# EAGLE design power_supply (EAGLE 6.6.0)
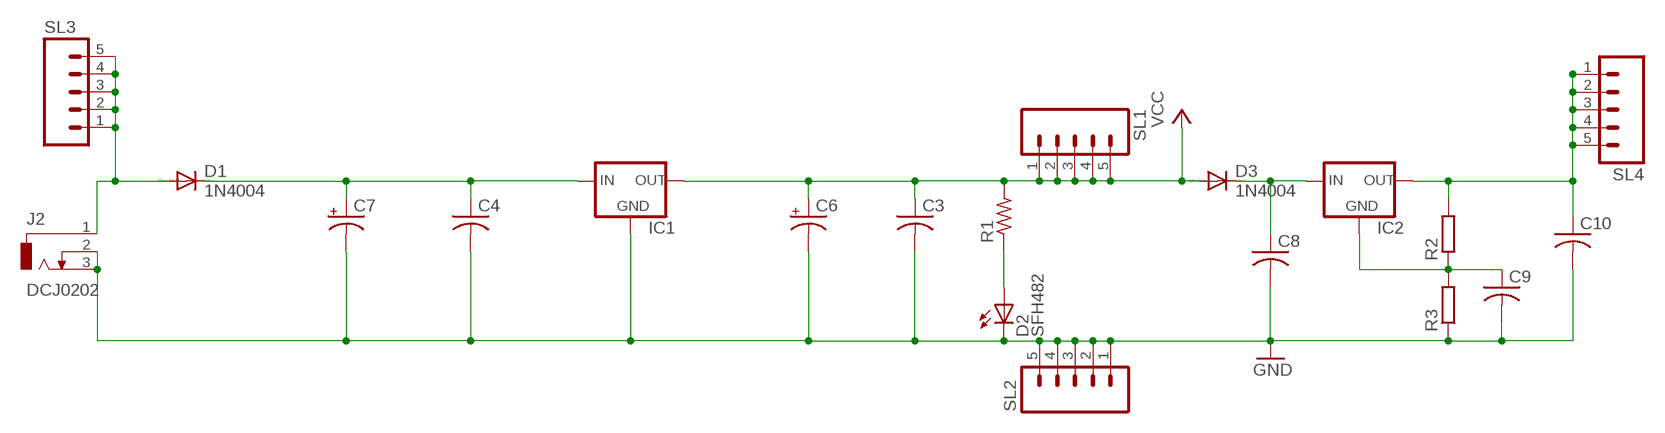
[diagram p0: schematic, sheet 1]

## Parts
C3  C-US025-025X050  [C025-025X050]
C4  C-US025-025X050  [C025-025X050]
C6  CPOL-USE3.5-10  [E3,5-10]
C7  CPOL-USE3.5-10  [E3,5-10]
C8  C-US025-025X050  [C025-025X050]
C9  C-US025-025X050  [C025-025X050]
C10  C-US025-025X050  [C025-025X050]
D1  1N4004  [DO41-10]
D2  SFH482  [SFH482]
D3  1N4004  [DO41-10]
IC1  78MXXS  [78MXXS]
IC2  78MXXS  [78MXXS]
J2  DCJ0202  [DCJ0202]
R1  R-US_0204/7  [0204/7]
R2  R-EU_0204/7  [0204/7]
R3  R-EU_0204/7  [0204/7]
SL1  M05  [05P]
SL2  M05  [05P]
SL3  M05  [05P]
SL4  M05  [05P]

## Nets
GND: C3.2 C4.2 C6.- C7.- C8.2 C9.2 C10.2 D2.K(C) IC1.GND J2.2 J2.3 R3.1 SL2.1 SL2.2 SL2.3 SL2.4 SL2.5
N$1: C4.1 C7.+ D1.C IC1.IN
N$2: D2.A R1.1
N$3: D1.A J2.1 SL3.1 SL3.2 SL3.3 SL3.4 SL3.5
N$4: C8.1 D3.C IC2.IN
N$5: C10.1 IC2.OUT R2.2 SL4.1 SL4.2 SL4.3 SL4.4 SL4.5
N$6: C9.1 IC2.GND R2.1 R3.2
VCC: C3.1 C6.+ D3.A IC1.OUT R1.2 SL1.1 SL1.2 SL1.3 SL1.4 SL1.5

## Library data of the parts
C3 C4 C8-C10 = rcl:C-US: CAPACITOR, American symbol
C6 C7 = resistor:CPOL-US: POLARIZED CAPACITOR, American symbol
D1 D3 = diode:1N4004: DIODE general purpose rectifier, 1 A
D2 = led:SFH482: IR LED infrared emitting diode, Infineon
IC1 IC2 = v-reg:78MXXS: VOLTAGE REGULATOR
J2 = con-jack:DCJ0202: DC POWER JACK Source: DCJ0202.pdf; OC_FARNELL: unknown; OC_NEWARK: unknown
R1 = resistor:R-US_: RESISTOR, American symbol
R2 R3 = rcl:R-EU_: RESISTOR, European symbol
SL1-SL4 = con-amp-quick:M05: AMP QUICK CONNECTOR; OC_FARNELL: unknown; OC_NEWARK: unknown

## Board
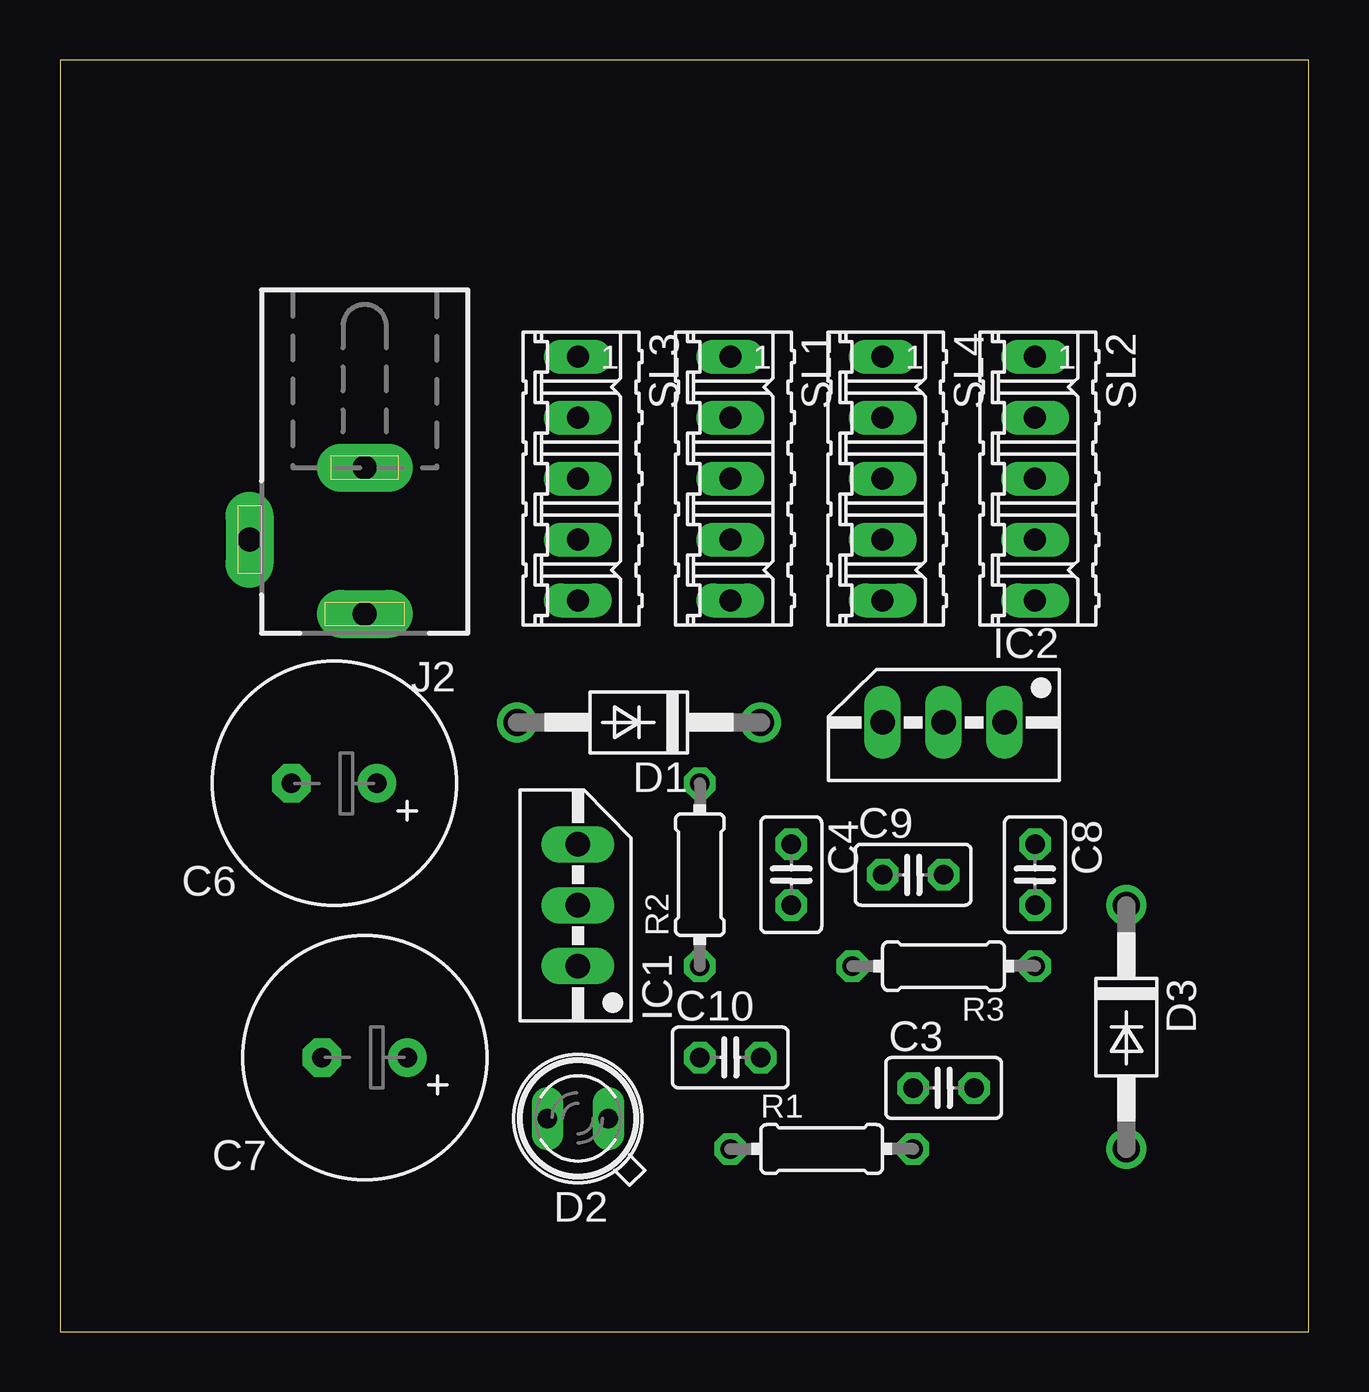
[diagram p1: board, top side]
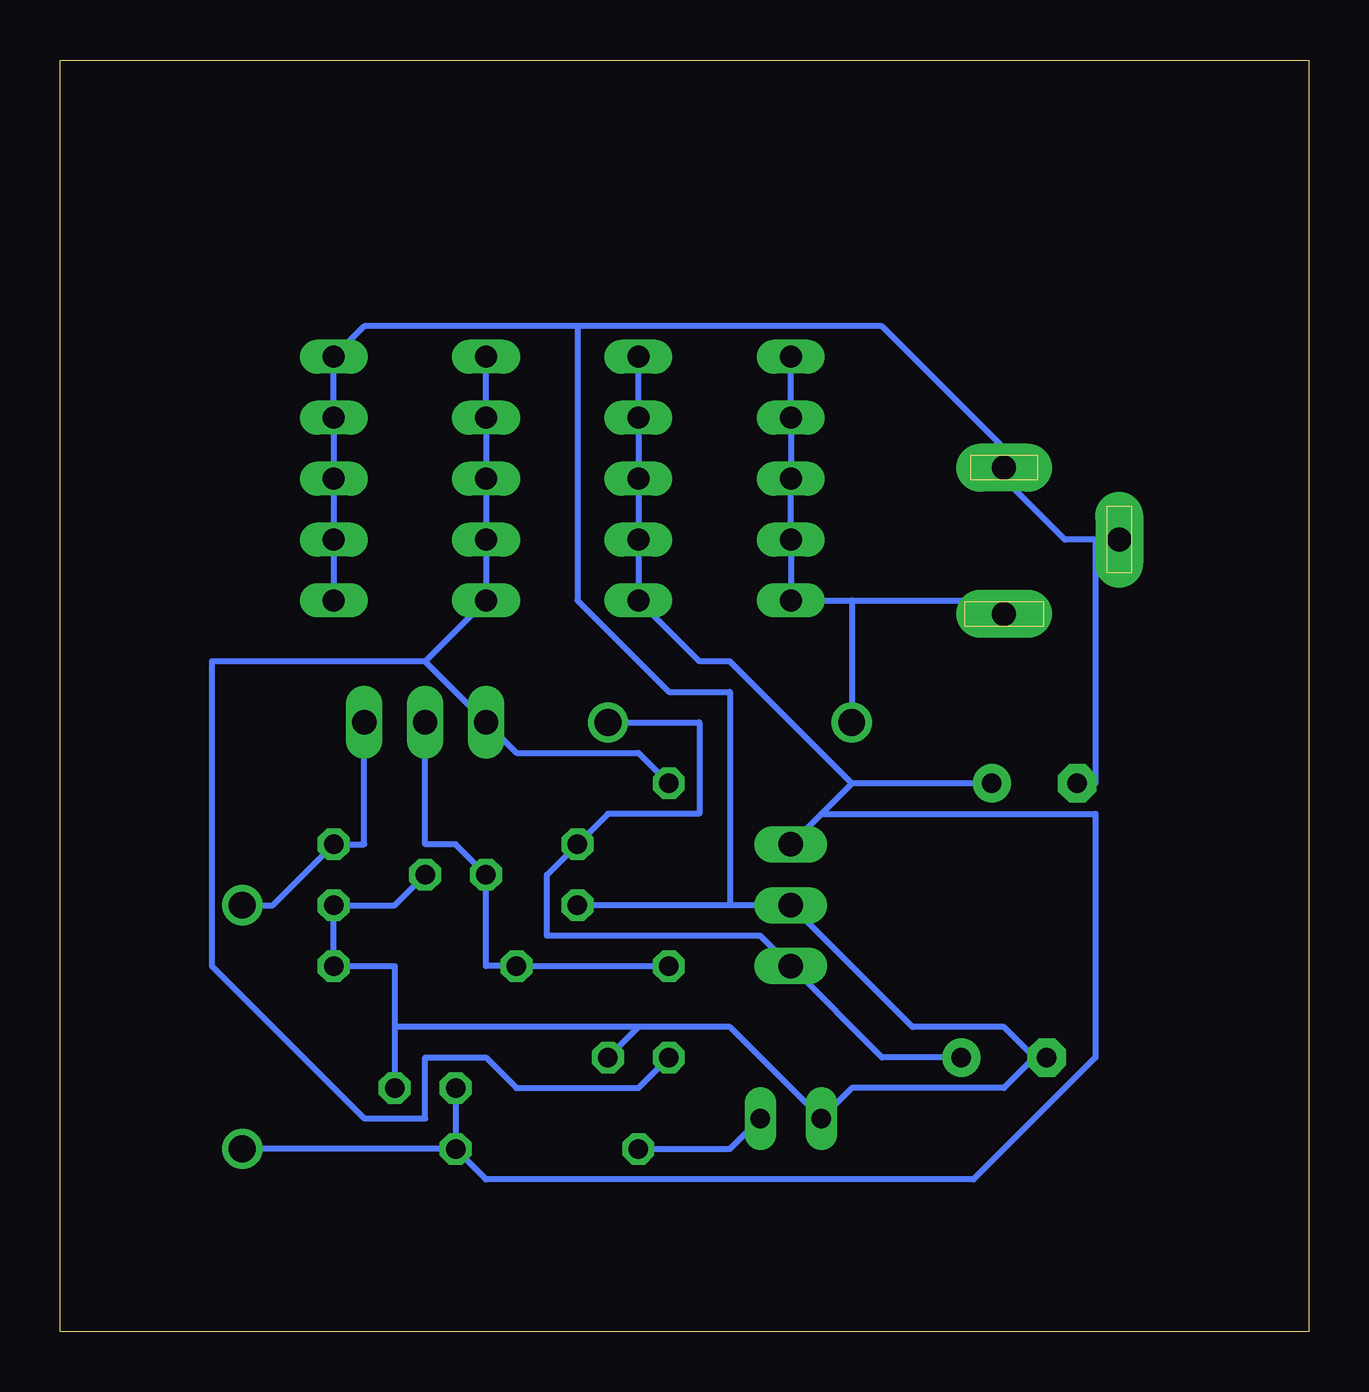
[diagram p2: board, bottom side, seen from below]

Size 52.05 x 53.01 mm. Coordinates in mm from the lower left corner, seen from the top.
Outline: 0,0 52.05,0 52.05,53.01 0,53.01 0,0
Copper layers (1*16): Top 0.035mm / dielectric 1.5mm / Bottom 0.035mm
Design rules "default": minimum track width 10mil, minimum drill 24mil, track to track 8mil, track to pad 8mil, pad to pad 8mil, via to via 8mil, smd to smd 8mil, copper to edge 40mil, drill to drill 8mil, minimum pad ring 10mil, minimum via ring 8mil, stop-mask expansion 4mil, vias tented up to drill 0mil, thermal gap 10mil

### Footprints (pad centres in the part's own frame; a part is rotated, then mirrored left to right if it is on the bottom)
C025-025X050 = drill 0.813 octagon: 1 -1.27,0; 2 1.27,0
E3,5-10 = drill 0.813 pad 1.6: + -1.778,0 | drill 0.813 pad 1.6 octagon: - 1.778,0
DO41-10 = drill 1.118: A 5.08,0; C -5.08,0
SFH482 = drill 0.813 long: A -1.27,0; K 1.27,0
78MXXS = drill 1.016 long: GND 0,-2.54; IN -2.54,-2.54; OUT 2.54,-2.54
DCJ0202 = drill 1 pad 2 long: 1 0,3.1; 2 4.8,0; 3 0,-3
0204/7 = drill 0.813 octagon: 1 -3.81,0; 2 3.81,0
05P = drill 0.914 long: 1 -5.08,0; 2 -2.54,0; 3 0,0; 4 2.54,0; 5 5.08,0

### Placement (x,y rotation side)
C3  36.83,10.16 0 top
C4  30.48,19.05 270 top
C6  11.43,22.86 180 top
C7  12.7,11.43 180 top
C8  40.64,19.05 270 top
C9  35.56,19.05 0 top
C10  27.94,11.43 0 top
D1  24.13,25.4 180 top
D2  21.59,8.89 180 top
D3  44.45,12.7 270 top
IC1  19.05,17.78 90 top
IC2  36.83,22.86 180 top
J2  12.7,33.02 180 top
R1  31.75,7.62 0 top
R2  26.67,19.05 90 top
R3  36.83,15.24 180 top
SL1  27.94,35.56 270 top
SL2  40.64,35.56 270 top
SL3  21.59,35.56 270 top
SL4  34.29,35.56 270 top

### Tracks (layer width: path | path; a pad name or v marks a point on that pad's centre or on a via)
GND
  Bottom 0.254: 38.1,12.7 38.1,15.24 R3.1 C8.2 38.1,17.78 C9.2 | 38.1,12.7 C3.2 | 24.13,17.78 IC1.GND 16.51,12.7 12.7,12.7 11.43,11.43 | 24.13,17.78 C4.2 | 11.43,11.43 12.7,10.16 19.05,10.16 D2.K 24.13,12.7 27.94,12.7 | 27.94,12.7 C10.2 | 11.43,11.43 C7.- | 27.94,12.7 38.1,12.7 | SL2.5 SL2.4 SL2.3 SL2.2 SL2.1 39.37,41.91 30.48,41.91 | 8.89,33.02 8.89,22.86 C6.- | 8.89,33.02 10.16,33.02 12.7,35.56 J2.3 12.7,36.83 17.78,41.91 30.48,41.91 | 8.89,33.02 J2.2 | 24.13,17.78 24.13,26.67 26.67,26.67 30.48,30.48 30.48,41.91
N$1
  Bottom 0.254: D1.C 25.4,25.4 25.4,21.59 29.21,21.59 C4.1 31.75,19.05 31.75,16.51 22.86,16.51 IC1.IN 17.78,11.43 C7.+
N$2
  Bottom 0.254: D2.A 24.13,7.62 R1.1
N$3
  Bottom 0.254: SL3.1 SL3.2 SL3.3 SL3.4 SL3.5 19.05,30.48 | 19.05,30.48 D1.A | 19.05,30.48 12.7,30.48 J2.1
N$4
  Bottom 0.254: D3.C 43.18,17.78 C8.1 39.37,20.32 IC2.IN
N$5
  Bottom 0.254: SL4.1 SL4.2 SL4.3 SL4.4 SL4.5 36.83,27.94 | C10.1 27.94,10.16 33.02,10.16 34.29,11.43 36.83,11.43 36.83,8.89 39.37,8.89 45.72,15.24 45.72,27.94 36.83,27.94 | 36.83,27.94 IC2.OUT 33.02,24.13 27.94,24.13 R2.2
N$6
  Bottom 0.254: R2.1 R3.2 34.29,15.24 C9.1 35.56,20.32 36.83,20.32 IC2.GND
VCC
  Bottom 0.254: C3.1 R1.2 | R1.2 D3.A | SL1.1 SL1.2 SL1.3 SL1.4 SL1.5 25.4,27.94 24.13,27.94 19.05,22.86 | 19.05,22.86 20.32,21.59 | 20.32,21.59 IC1.OUT | C6.+ 19.05,22.86 | R1.2 34.29,6.35 13.97,6.35 8.89,11.43 8.89,21.59 20.32,21.59